# Altium project DM3370.PrjPcb (part 6 of 14)

## Sheet DM3370_OV9782_3-4.SchDoc: =project_title
size Tabloid; PageSetup: Record=PageOptions|CenterHorizontal=True|CenterVertical=True|PrintScale=0.71|XCorrection=1.00|YCorrection=1.00|PrintKind=0|BorderSize=5000000|LeftOffset=0|BottomOffset=0|Orientation=2|PaperLength=1000|PaperWidth=1000|Scale=100|PaperSource=7|PrintQuality=-4|MediaType=1|DitherType=10|PrintScaleMode=1|PaperKind=A4; CompanyName: Luxonis Holding; DrawnBy: David Malovrh; Organization: Luxonis Holding; Address1: 1925 Harmony Park Drive; Address2: Westminster, CO; Address3: 80234; Address4: United States; DocumentNumber: 10; Revision: R5M2E5; SheetNumber: 10; SheetTotal: 17
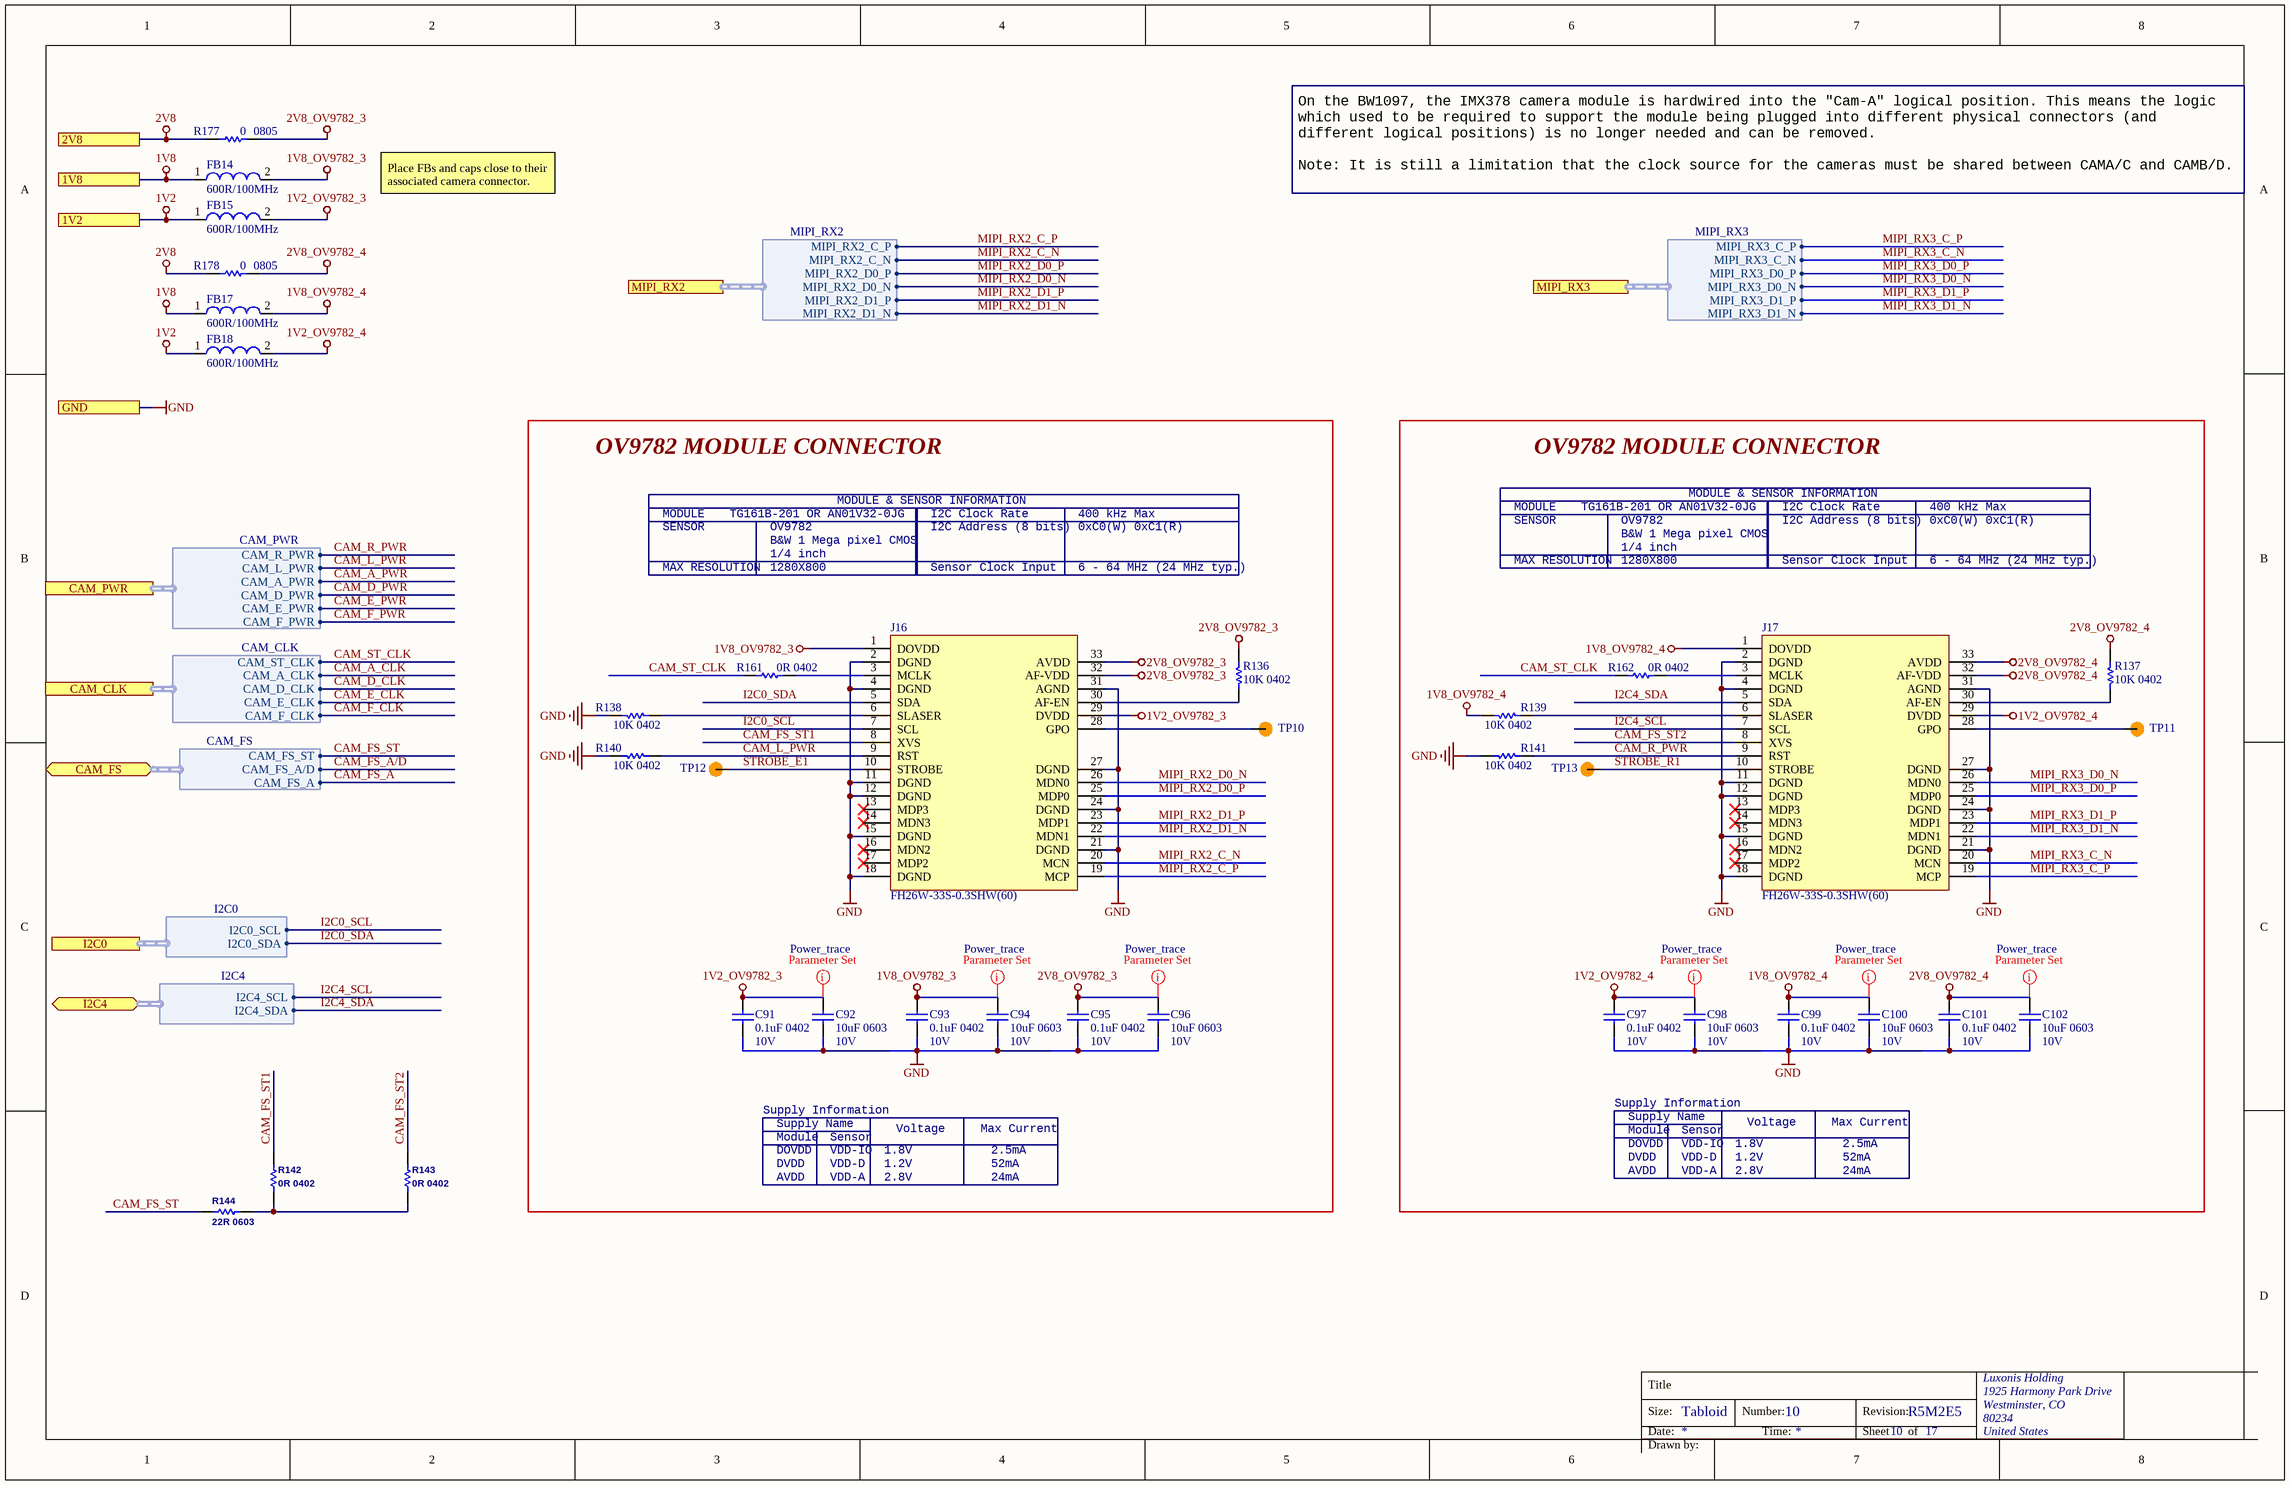
[diagram p10: DM3370_OV9782_3-4.SchDoc]

### Parts
C91  0.1uF 0402  Voltage Rating: 10V  [CAPC0402(1005)70_L]
C92  10uF 0603  Voltage Rating: 10V  [CAPC0603(1608)100_L]
C93  0.1uF 0402  Voltage Rating: 10V  [CAPC0402(1005)70_L]
C94  10uF 0603  Voltage Rating: 10V  [CAPC0603(1608)100_L]
C95  0.1uF 0402  Voltage Rating: 10V  [CAPC0402(1005)70_L]
C96  10uF 0603  Voltage Rating: 10V  [CAPC0603(1608)100_L]
C97  0.1uF 0402  Voltage Rating: 10V  [CAPC0402(1005)70_L]
C98  10uF 0603  Voltage Rating: 10V  [CAPC0603(1608)100_L]
C99  0.1uF 0402  Voltage Rating: 10V  [CAPC0402(1005)70_L]
C100  10uF 0603  Voltage Rating: 10V  [CAPC0603(1608)100_L]
C101  0.1uF 0402  Voltage Rating: 10V  [CAPC0402(1005)70_L]
C102  10uF 0603  Voltage Rating: 10V  [CAPC0603(1608)100_L]
FB14  600R/100MHz  [2508056017Y2]
FB15  600R/100MHz  [2508056017Y2]
FB17  600R/100MHz  [2508056017Y2]
FB18  600R/100MHz  [2508056017Y2]
J16  FH26W-33S-0.3SHW(60)  [FH26W-33S-0.3SHW(60)]
J17  FH26W-33S-0.3SHW(60)  [FH26W-33S-0.3SHW(60)]
R136  10K 0402  [RESC0402(1005)_L]
R137  10K 0402  [RESC0402(1005)_L]
R138  10K 0402  [RESC0402(1005)_L]
R139  10K 0402  [RESC0402(1005)_L]
R140  10K 0402  [RESC0402(1005)_L]
R141  10K 0402  [RESC0402(1005)_L]
R142  0R 0402  [RESC0402(1005)_L]
R143  0R 0402  [RESC0402(1005)_L]
R144  22R 0603  [RESC0603(1608)_L]
R161  0R 0402  [RESC0402(1005)_L]
R162  0R 0402  [RESC0402(1005)_L]
R177  value 0  Case/Package: 0805  [RESC0805(2012)_L]  (hidden comment: CRCW08050000Z0EA)
R178  value 0  Case/Package: 0805  [RESC0805(2012)_L]  (hidden comment: CRCW08050000Z0EA)
TP10  TP100_200_NS  [TP100_200_NS]  (value not drawn)  (no BOM)
TP11  TP100_200_NS  [TP100_200_NS]  (value not drawn)  (no BOM)
TP12  TP100_200_NS  [TP100_200_NS]  (value not drawn)  (no BOM)
TP13  TP100_200_NS  [TP100_200_NS]  (value not drawn)  (no BOM)

### Blocks framed on the sheet
OV9782 MODULE CONNECTOR: C91-C96 J16 R136 R138 R140 R161 TP10 TP12
OV9782 MODULE CONNECTOR: C97-C102 J17 R137 R139 R141 R162 TP11 TP13

### Ports
1V2, 1V8, 2V8, CAM_CLK (harness CAM_CLK), CAM_FS (bidir, harness CAM_FS), CAM_PWR (harness CAM_PWR), GND, I2C0 (harness I2C0), I2C4 (bidir, harness I2C4), MIPI_RX2 (harness MIPI_RX2), MIPI_RX3 (harness MIPI_RX3)

### Harnesses
CAM_PWR: CAM_R_PWR, CAM_L_PWR, CAM_A_PWR, CAM_D_PWR, CAM_E_PWR, CAM_F_PWR
CAM_CLK: CAM_ST_CLK, CAM_A_CLK, CAM_D_CLK, CAM_E_CLK, CAM_F_CLK
CAM_FS: CAM_FS_ST, CAM_FS_A/D, CAM_FS_A
I2C0: I2C0_SCL, I2C0_SDA
I2C4: I2C4_SCL, I2C4_SDA
MIPI_RX2: MIPI_RX2_C_P, MIPI_RX2_C_N, MIPI_RX2_D0_P, MIPI_RX2_D0_N, MIPI_RX2_D1_P, MIPI_RX2_D1_N
MIPI_RX3: MIPI_RX3_C_P, MIPI_RX3_C_N, MIPI_RX3_D0_P, MIPI_RX3_D0_N, MIPI_RX3_D1_P, MIPI_RX3_D1_N

### Nets
1V2: FB15.1 FB18.1 ; port 1V2
1V2_OV9782_3: C91.2 C92.2 FB15.2 J16.29(DVDD)
1V2_OV9782_4: C97.2 C98.2 FB18.2 J17.29(DVDD)
1V8: FB14.1 FB17.1 ; port 1V8
1V8_OV9782_3: C93.2 C94.2 FB14.2 J16.1(DOVDD)
1V8_OV9782_4: C99.2 C100.2 FB17.2 J17.1(DOVDD) R139.2
2V8: R177.1 R178.1 ; port 2V8
2V8_OV9782_3: C95.2 C96.2 J16.32(AF-VDD) J16.33(AVDD) R136.1 R177.2
2V8_OV9782_4: C101.2 C102.2 J17.32(AF-VDD) J17.33(AVDD) R137.1 R178.2
GND: C91.1 C92.1 C93.1 C94.1 C95.1 C96.1 C97.1 C98.1 C99.1 C100.1 C101.1 C102.1 J16.2(DGND) J16.4(DGND) J16.11(DGND) J16.12(DGND) J16.15(DGND) J16.18(DGND) J16.21(DGND) J16.24(DGND) J16.27(DGND) J16.31(AGND) J17.2(DGND) J17.4(DGND) J17.11(DGND) J17.12(DGND) J17.15(DGND) J17.18(DGND) J17.21(DGND) J17.24(DGND) J17.27(DGND) J17.31(AGND) R138.2 R140.2 R141.2 ; port GND
CAM_D_CLK: port CAM_CLK.CAM_D_CLK
CAM_E_CLK: port CAM_CLK.CAM_E_CLK
CAM_F_CLK: port CAM_CLK.CAM_F_CLK
CAM_F_PWR: port CAM_PWR.CAM_F_PWR
CAM_FS_A/D: port CAM_FS.CAM_FS_A/D
CAM_FS_ST: R144.2 ; port CAM_FS.CAM_FS_ST
CAM_FS_ST1: J16.8(XVS) R142.2
CAM_FS_ST2: J17.8(XVS) R143.2
CAM_L_PWR: J16.9(RST) R140.1 ; port CAM_PWR.CAM_L_PWR
CAM_R_PWR: J17.9(RST) R141.1 ; port CAM_PWR.CAM_R_PWR
CAM_ST_CLK: R161.1 R162.1 ; port CAM_CLK.CAM_ST_CLK
I2C0_SCL: J16.7(SCL) ; port I2C0.I2C0_SCL
I2C0_SDA: J16.5(SDA) ; port I2C0.I2C0_SDA
I2C4_SCL: J17.7(SCL) ; port I2C4.I2C4_SCL
I2C4_SDA: J17.5(SDA) ; port I2C4.I2C4_SDA
MIPI_RX2_C_N: J16.20(MCN) ; port MIPI_RX2.MIPI_RX2_C_N
MIPI_RX2_C_P: J16.19(MCP) ; port MIPI_RX2.MIPI_RX2_C_P
MIPI_RX2_D0_N: J16.26(MDN0) ; port MIPI_RX2.MIPI_RX2_D0_N
MIPI_RX2_D0_P: J16.25(MDP0) ; port MIPI_RX2.MIPI_RX2_D0_P
MIPI_RX2_D1_N: J16.22(MDN1) ; port MIPI_RX2.MIPI_RX2_D1_N
MIPI_RX2_D1_P: J16.23(MDP1) ; port MIPI_RX2.MIPI_RX2_D1_P
MIPI_RX3_C_N: J17.20(MCN) ; port MIPI_RX3.MIPI_RX3_C_N
MIPI_RX3_C_P: J17.19(MCP) ; port MIPI_RX3.MIPI_RX3_C_P
MIPI_RX3_D0_N: J17.26(MDN0) ; port MIPI_RX3.MIPI_RX3_D0_N
MIPI_RX3_D0_P: J17.25(MDP0) ; port MIPI_RX3.MIPI_RX3_D0_P
MIPI_RX3_D1_N: J17.22(MDN1) ; port MIPI_RX3.MIPI_RX3_D1_N
MIPI_RX3_D1_P: J17.23(MDP1) ; port MIPI_RX3.MIPI_RX3_D1_P
STROBE_E1: J16.10(STROBE) TP12.1
STROBE_R1: J17.10(STROBE) TP13.1
NetJ16_3: J16.3(MCLK) R161.2
NetJ16_6: J16.6(SLASER) R138.1
NetJ16_28: J16.28(GPO) TP10.1
NetJ16_30: J16.30(AF-EN) R136.2
NetJ17_3: J17.3(MCLK) R162.2
NetJ17_6: J17.6(SLASER) R139.1
NetJ17_28: J17.28(GPO) TP11.1
NetJ17_30: J17.30(AF-EN) R137.2
NetR142_1: R142.1 R143.1 R144.1

Not connected (* = marked no-connect by the designer): J16 13(MDP3)* 14(MDN3)* 16(MDN2)* 17(MDP2)*; J17 13(MDP3)* 14(MDN3)* 16(MDN2)* 17(MDP2)*

### Layout directives
net class Power_trace: 1V2_OV9782_3, 1V2_OV9782_4, 1V8_OV9782_3, 1V8_OV9782_4, 2V8_OV9782_3, 2V8_OV9782_4

### Notes on the sheet
- Place FBs and caps close to their associated camera connector.
- On the BW1097, the IMX378 camera module is hardwired into the "Cam-A" logical position. This means the logic which used to be required to support the module being plugged into different physical connectors (and different logical positions) is no longer needed and can be removed.
  Note: It is still a limitation that the clock source for the cameras must be shared between CAMA/C and CAMB/D.
- MODULE & SENSOR INFORMATION
- SENSOR
- MODULE
- MAX RESOLUTION
- TG161B-201 OR AN01V32-0JG
- B&W 1 Mega pixel CMOS
- 1280X800
- OV9782
- 1/4 inch
- I2C Address (8 bits)
- I2C Clock Rate
- Sensor Clock Input
- 400 kHz Max
- 6 - 64 MHz (24 MHz typ.)
- 0xC0(W) 0xC1(R)
- Supply Information
- DOVDD
- DVDD
- Supply Name
- Module
- VDD-IO
- VDD-D
- Sensor
- 1.8V
- 1.2V
- Voltage
- Max Current
- 2.5mA
- 52mA
- AVDD
- VDD-A
- 2.8V
- 24mA
- Title
- Size:
- Date:
- Tabloid
- Number:
- Time:
- Revision:
- Sheet
- of
- Drawn by:

### Library data of the parts
C91 C93 C95 C97 C99 C101 = GRM155R71A104JA01D: as C158 on sheet DM3370_LCD_LEDring; Manufacturer Part Number 1: GRM155R71A104JA01D; Supplier 1: Digi-Key; Stock 1: 1346709; Pricing 1: 1=0.10000, 10=0.02500, 100=0.01130, 500=0.00806, 1000=0.00633, 2500=0.00575, 5000=0.00529 (USD); RoHS: Yes; Mount: Surface Mount; Case/Package: 0402; Case Code (Imperial): 0402; Case Code (Metric): 1005; Min Operating Temperature: -55°C; Max Operating Temperature: 125°C; Tolerance: 5%; Packaging: Tape and Reel; Voltage Rating (DC): 10V; Dielectric: X7R; Package Quantity: 10000; Termination: SMD/SMT; Length: 1mm; Height: 0.5mm; Width: 0.02inch; Thickness: 0.022inch; Depth: 0.5mm; Radiation Hardening: No; Lead Free: Lead Free; ComponentLink1URL: https://datasheet.ciiva.com/5411/product-5411135.pdf?src-supplier=Mouser; ComponentLink1Description: https://datasheet.ciiva.com/5411/product-5411135.pdf?src-supplier=Mouser; ComponentLink2URL: https://datasheet.ciiva.com/11618/c02e-11618821.pdf?src-supplier=Avnet; ComponentLink2Description: https://datasheet.ciiva.com/11618/c02e-11618821.pdf?src-supplier=Avnet; Supplier Part Number 1: 490-10777-1-ND
C92 C94 C96 C98 C100 C102 = GRM188R61A106ME69D: as C169 on sheet DM3370_LCD_LEDring; Manufacturer Part Number 1: GRM188R61A106ME69D; Supplier 1: Digi-Key; Stock 1: 2873098; Pricing 1: 1=0.21000, 10=0.14100, 100=0.07130, 500=0.04876, 1000=0.04313 (USD); RoHS: Yes; Mount: Surface Mount; Case/Package: 0603; Weight: 0.000222oz; Case Code (Metric): 1608; Case Code (Imperial): 0603; Min Operating Temperature: -55°C; Max Operating Temperature: 85°C; Packaging: Tape and Reel; Tolerance: 20%; Capacitance: 10uF; Dielectric: X5R; Voltage Rating (DC): 10V; Package Quantity: 4000; Termination: SMD/SMT; Length: 1.6mm; Height: 0.8mm; Width: 0.8mm; Thickness: 0.035inch; Depth: 0.8mm; REACH SVHC: Unknown; Lead Free: Lead Free; ComponentLink1URL: http://www.mouser.com/ds/2/281/c02e-2905.pdf?src-supplier=Mouser; ComponentLink1Description: http://www.mouser.com/ds/2/281/c02e-2905.pdf?src-supplier=Mouser; ComponentLink2URL: http://components.arrow.com/part/dataview/0323_06119472?src-supplier=Arrow+Europe; ComponentLink2Description: http://components.arrow.com/part/dataview/0323_06119472?src-supplier=Arrow+Europe; ComponentLink3URL: http://www.farnell.com/datasheets/2048014.pdf?src-supplier=Farnell; ComponentLink3Description: http://www.farnell.com/datasheets/2048014.pdf?src-supplier=Farnell; ComponentLink4URL: http://www.farnell.com/datasheets/1872210.pdf?src-supplier=Farnell; ComponentLink4Description: http://www.farnell.com/datasheets/1872210.pdf?src-supplier=Farnell; ComponentLink5URL: http://search.murata.co.jp/Ceramy/image/img/A01X/G101/ENG/GRM188R61A106ME69-01.pdf?src-supplier=Digi-Key; ComponentLink5Description: http://search.murata.co.jp/Ceramy/image/img/A01X/G101/ENG/GRM188R61A106ME69-01.pdf?src-supplier=Digi-Key; ComponentLink6URL: http://www.farnell.com/datasheets/1872210.pdf?src-supplier=Newark; ComponentLink6Description: http://www.farnell.com/datasheets/1872210.pdf?src-supplier=Newark; ComponentLink7URL: http://www.farnell.com/datasheets/2048014.pdf?src-supplier=Element14; ComponentLink7Description: http://www.farnell.com/datasheets/2048014.pdf?src-supplier=Element14; ComponentLink8URL: http://www.farnell.com/datasheets/2048014.pdf?src-supplier=Newark; ComponentLink8Description: http://www.farnell.com/datasheets/2048014.pdf?src-supplier=Newark; Supplier Part Number 1: 490-10475-1-ND
FB14 FB15 FB17 FB18 = 2508056017Y2: as FB7 on sheet DM3370_LCD_LEDring; Manufacturer Part Number 1: 2508056017Y2; Supplier 1: Digi-Key; Stock 1: 100491; Pricing 1: 1=0.10000, 10=0.07900, 25=0.07120, 50=0.05240, 100=0.04520, 250=0.03568, 500=0.03014, 1000=0.02538 (USD); RoHS: Yes; Case/Package: 0805; Number of Pins: 2; Case Code (Metric): 2012; Case Code (Imperial): 0805; Min Operating Temperature: -55°C; Max Operating Temperature: 125°C; Package Quantity: 4000; Packaging: Tape and Reel; Max DC Current: 2A; Termination: SMD/SMT; Military Standard: Not; DC Current: 2A; Current Rating: 2A; Frequency: 100MHz; Length: 2mm; Height: 0.9mm; Width: 1.25mm; Depth: 1.25mm; Radiation Hardening: No; REACH SVHC: No SVHC; ComponentLink1URL: https://datasheet.ciiva.com/3854/3802508056017y2-3854245.pdf?src-supplier=Arrow; ComponentLink1Description: https://datasheet.ciiva.com/3854/3802508056017y2-3854245.pdf?src-supplier=Arrow; ComponentLink2URL: https://datasheet.ciiva.com/22735/652149-22735047.pdf?src-supplier=Element14; ComponentLink2Description: https://datasheet.ciiva.com/22735/652149-22735047.pdf?src-supplier=Element14; ComponentLink3URL: https://datasheet.ciiva.com/1127/26143-1127514.pdf?src-supplier=Farnell; ComponentLink3Description: https://datasheet.ciiva.com/1127/26143-1127514.pdf?src-supplier=Farnell; ComponentLink4URL: https://datasheet.ciiva.com/18090/getdatasheetpartid-212640-18090187.pdf?src-supplier=Verical; ComponentLink4Description: https://datasheet.ciiva.com/18090/getdatasheetpartid-212640-18090187.pdf?src-supplier=Verical; ComponentLink5URL: https://datasheet.ciiva.com/7620/26143-7620140.pdf?src-supplier=Element14; ComponentLink5Description: https://datasheet.ciiva.com/7620/26143-7620140.pdf?src-supplier=Element14; Supplier Part Number 1: 1934-1487-1-ND
J16 J17 = CMP-002-00090-2: as J14 on sheet DM3370_OV9782_1-2; Design Item ID: FH26W-33S-0.3SHW(60); Stock 1: 627; ComponentLink2URL: https://www.hirose.com/product/en/download_file/key_name/FH26/category/Catalog/doc_file_id/49355/?file_category_id=4&item_id=298&is_series=1&src-supplier=Digi-Key; Category: FFC / FPC; ComponentLink3Description: https://www.hirose.com/product/download/?distributor=digikey&amp;type=2d&amp;lang=en&amp;num=FH26W-13S-0.3SHW(60)&src-supplier=Digi-Key; Manufacturer Part Number 1: FH26W-33S-0.3SHW(60); ComponentLink1Description: https://datasheet.ciiva.com:443/pdfs/VipMasterIC/IC/HIRO/HIRO-S-A0007913874/HIRO-S-A0008593114-1.pdf?src-supplier=IHS+Markit; ComponentLink1URL: https://datasheet.ciiva.com:443/pdfs/VipMasterIC/IC/HIRO/HIRO-S-A0007913874/HIRO-S-A0008593114-1.pdf?src-supplier=IHS+Markit; RoHS: Yes; ComponentLink3URL: https://www.hirose.com/product/download/?distributor=digikey&amp;type=2d&amp;lang=en&amp;num=FH26W-13S-0.3SHW(60)&src-supplier=Digi-Key; ComponentLink2Description: https://www.hirose.com/product/en/download_file/key_name/FH26/category/Catalog/doc_file_id/49355/?file_category_id=4&item_id=298&is_series=1&src-supplier=Digi-Key; Pricing 1: 1=1,78000, 10=1,61700, 25=1,51800, 50=1,45200, 100=1,38600, 250=1,25400, 500=1,15500, 1000=0,99000, 2500=0,92400 (USD); Source: LuxonisMaster.SchLib
R136-R141 = RC0402FR-1310KL: as R118 on sheet DM3370_LCD_LEDring; ComponentLink1URL: https://datasheet.ciiva.com/16940/pyu-rc0402-51-rohs-l-6-16940293.pdf?src-supplier=Avnet+Europe; ComponentLink1Description: https://datasheet.ciiva.com/16940/pyu-rc0402-51-rohs-l-6-16940293.pdf?src-supplier=Avnet+Europe; ComponentLink2URL: https://datasheet.ciiva.com/28386/pyu-rc0402-51-rohs-l-6-28386855.pdf?src-supplier=Avnet+Europe; ComponentLink2Description: https://datasheet.ciiva.com/28386/pyu-rc0402-51-rohs-l-6-28386855.pdf?src-supplier=Avnet+Europe; ComponentLink3URL: https://datasheet.ciiva.com/16740/pyu-rc0402-51-rohs-l-6-r-16740602.pdf?src-supplier=Future+Electronics; ComponentLink3Description: https://datasheet.ciiva.com/16740/pyu-rc0402-51-rohs-l-6-r-16740602.pdf?src-supplier=Future+Electronics; ComponentLink4URL: https://datasheet.ciiva.com/8891/pyu-rc0402-51-rohs-l-6-8891339.pdf?src-supplier=Avnet; ComponentLink4Description: https://datasheet.ciiva.com/8891/pyu-rc0402-51-rohs-l-6-8891339.pdf?src-supplier=Avnet; ComponentLink5URL: https://datasheet.ciiva.com/5557/pyu-rc0402-51-rohs-l-6-r-5557997.pdf?src-supplier=Mouser; ComponentLink5Description: https://datasheet.ciiva.com/5557/pyu-rc0402-51-rohs-l-6-r-5557997.pdf?src-supplier=Mouser; ComponentLink6URL: https://datasheet.ciiva.com/7983/1018594-7983533.pdf?src-supplier=Element14; ComponentLink6Description: https://datasheet.ciiva.com/7983/1018594-7983533.pdf?src-supplier=Element14; Supplier 1: Newark; Manufacturer Part Number 1: RC0402FR-1310KL; Stock 1: 62239; Pricing 1: 1=0.10000, 25=0.01200, 100=0.00400, 250=0.00400, 500=0.00300, 1000=0.00300 (USD); RoHS: Yes; Case/Package: 0402; Number of Pins: 2; Contact Plating: Tin,Matte,Lead; Case Code (Imperial): 0402; Case Code (Metric): 1005; Min Operating Temperature: -55°C; Max Operating Temperature: 155°C; Tolerance: 1%; Composition: Thick Film; Packaging: Tape and Reel; Termination: SMD/SMT; Military Standard: Not; Voltage Rating (DC): 50V; Working Voltage: 50V; Number of Terminations: 2; Length: 1mm; Depth: 0.5mm; Radiation Hardening: No; REACH SVHC: No SVHC; Lead Free: Lead Free; Supplier Part Number 1: 67R9960; Supplier 2: Future Electronics; Supplier 3: Mouser; Supplier 4: Element14; Supplier Part Number 2: RC0402FR-1310KL-CUTT; Supplier Part Number 3: 603-RC0402FR-1310KL; Supplier Part Number 4: 1799235
R142 R143 R161 R162 = CRCW04020000Z0ED: as R158 on sheet DM3370_LCD_LEDring; Supplier 1: Digi-Key; Manufacturer Part Number 1: CRCW04020000Z0ED; Stock 1: 855968; Pricing 1: 1=0.10000, 10=0.03400, 25=0.02440, 50=0.01860, 100=0.01380, 250=0.01048, 500=0.00840, 1000=0.00618, 5000=0.00443 (USD); RoHS: Yes; Mount: Surface Mount; Case/Package: 0402; Weight: 2.3E-05oz; Case Code (Imperial): 0402; Case Code (Metric): 1005; Contact Plating: Tin; Min Operating Temperature: -55°C; Max Operating Temperature: 155°C; Packaging: Tape and Reel; Composition: Thick Film; Voltage Rating (DC): 50V; Package Quantity: 1; Termination: SMD/SMT; Number of Terminations: 2; Military Standard: Not; Max Power Dissipation: 63mW; Features: Automotive AEC-Q200; Length: 1mm; Height: 0.35mm; Width: 0.5mm; Depth: 0.5mm; Radiation Hardening: No; REACH SVHC: Unknown; Lead Free: Lead Free; ComponentLink1URL: https://datasheet.ciiva.com/3255/dcrcwe3-3255944.pdf?src-supplier=Avnet; ComponentLink1Description: https://datasheet.ciiva.com/3255/dcrcwe3-3255944.pdf?src-supplier=Avnet; ComponentLink2URL: https://datasheet.ciiva.com/3255/dcrcwe3-3255945.pdf?src-supplier=Avnet; ComponentLink2Description: https://datasheet.ciiva.com/3255/dcrcwe3-3255945.pdf?src-supplier=Avnet; ComponentLink3URL: https://datasheet.ciiva.com/16881/dcrcwe3-16881413.pdf?src-supplier=Avnet+Europe; ComponentLink3Description: https://datasheet.ciiva.com/16881/dcrcwe3-16881413.pdf?src-supplier=Avnet+Europe; ComponentLink4URL: https://datasheet.ciiva.com/2461/dcrcwe3-2461962.pdf?src-supplier=Digi-Key; ComponentLink4Description: https://datasheet.ciiva.com/2461/dcrcwe3-2461962.pdf?src-supplier=Digi-Key; ComponentLink5URL: https://datasheet.ciiva.com/7841/1720486-7841802.pdf?src-supplier=Element14; ComponentLink5Description: https://datasheet.ciiva.com/7841/1720486-7841802.pdf?src-supplier=Element14; ComponentLink6URL: https://datasheet.ciiva.com/2461/dcrcwe3-2461963.pdf?src-supplier=Digi-Key; ComponentLink6Description: https://datasheet.ciiva.com/2461/dcrcwe3-2461963.pdf?src-supplier=Digi-Key; ComponentLink7URL: https://datasheet.ciiva.com/2461/dcrcwe3-2461964.pdf?src-supplier=Digi-Key; ComponentLink7Description: https://datasheet.ciiva.com/2461/dcrcwe3-2461964.pdf?src-supplier=Digi-Key; ComponentLink8URL: https://datasheet.ciiva.com/7841/1697337-7841468.pdf?src-supplier=Element14; ComponentLink8Description: https://datasheet.ciiva.com/7841/1697337-7841468.pdf?src-supplier=Element14; ComponentLink9URL: https://datasheet.ciiva.com/16761/70200976-16761309.pdf?src-supplier=Allied+Electronics; ComponentLink9Description: https://datasheet.ciiva.com/16761/70200976-16761309.pdf?src-supplier=Allied+Electronics; ComponentLink10URL: https://datasheet.ciiva.com/26311/fld-crcw-e3-data-en-26311550.pdf?src-supplier=Distrelec; ComponentLink10Description: https://datasheet.ciiva.com/26311/fld-crcw-e3-data-en-26311550.pdf?src-supplier=Distrelec; Supplier Part Number 1: 541-0.0JCT-ND
R144 = RC0603FR-0722RL: as R23 on sheet DM3370_Motor; Supplier 1: Digi-Key; Manufacturer Part Number 1: RC0603FR-0722RL; Stock 1: 3640176; Pricing 1: 1=0.10000, 10=0.02300, 100=0.00940, 1000=0.00421, 2500=0.00366 (USD); RoHS: Yes; Case/Package: 0603; Number of Pins: 2; Case Code (Metric): 1608; Case Code (Imperial): 0603; Min Operating Temperature: -55°C; Max Operating Temperature: 155°C; Tolerance: 1%; Resistance: 22R; Packaging: Tape and Reel; Composition: Thick Film; Voltage Rating (DC): 50V; Package Quantity: 1; Termination: SMD/SMT; Military Standard: Not; Number of Terminations: 2; Max Power Dissipation: 100mW; Features: Moisture Resistant; Length: 1.6mm; Height: 0.022inch; Width: 0.031inch; Depth: 0.8mm; REACH SVHC: No SVHC; Lead Free: Lead Free; ComponentLink1URL: https://datasheet.ciiva.com/11819/0900766b80f96399-11819285.pdf?src-supplier=RSComponents; ComponentLink1Description: https://datasheet.ciiva.com/11819/0900766b80f96399-11819285.pdf?src-supplier=RSComponents; ComponentLink2URL: https://datasheet.ciiva.com/2454/pyu-r-int-thick-7-2454354.pdf?src-supplier=Digi-Key; ComponentLink2Description: https://datasheet.ciiva.com/2454/pyu-r-int-thick-7-2454354.pdf?src-supplier=Digi-Key; ComponentLink3URL: https://datasheet.ciiva.com/2454/pyu-r-int-thick-7-2454355.pdf?src-supplier=Digi-Key; ComponentLink3Description: https://datasheet.ciiva.com/2454/pyu-r-int-thick-7-2454355.pdf?src-supplier=Digi-Key; ComponentLink4URL: https://datasheet.ciiva.com/2454/pyu-r-int-thick-7-2454356.pdf?src-supplier=Digi-Key; ComponentLink4Description: https://datasheet.ciiva.com/2454/pyu-r-int-thick-7-2454356.pdf?src-supplier=Digi-Key; ComponentLink5URL: https://datasheet.ciiva.com/46440/1868787-46440901.pdf?src-supplier=Element14; ComponentLink5Description: https://datasheet.ciiva.com/46440/1868787-46440901.pdf?src-supplier=Element14; ComponentLink6URL: https://datasheet.ciiva.com/46395/443971-46395032.pdf?src-supplier=Element14; ComponentLink6Description: https://datasheet.ciiva.com/46395/443971-46395032.pdf?src-supplier=Element14; Supplier 2: Newark; Supplier 3: Mouser; Supplier Part Number 2: 26M6754; Supplier Part Number 3: 603-RC0603FR-0722RL; Supplier Part Number 1: 311-22.0HRCT-ND
R177 R178 = CMP-013-000034-9: as R19 on sheet DM3370_OV9782_1-2; Design Item ID: CRCW08050000Z0EA; Manufacturer Part Number 1: CRCW08050000Z0EA; Max Operating Temperature: 155°C; Min Operating Temperature: -55°C
TP10-TP13 = TEST_POINT